# EAGLE schematic touch (EAGLE 7.3.0)
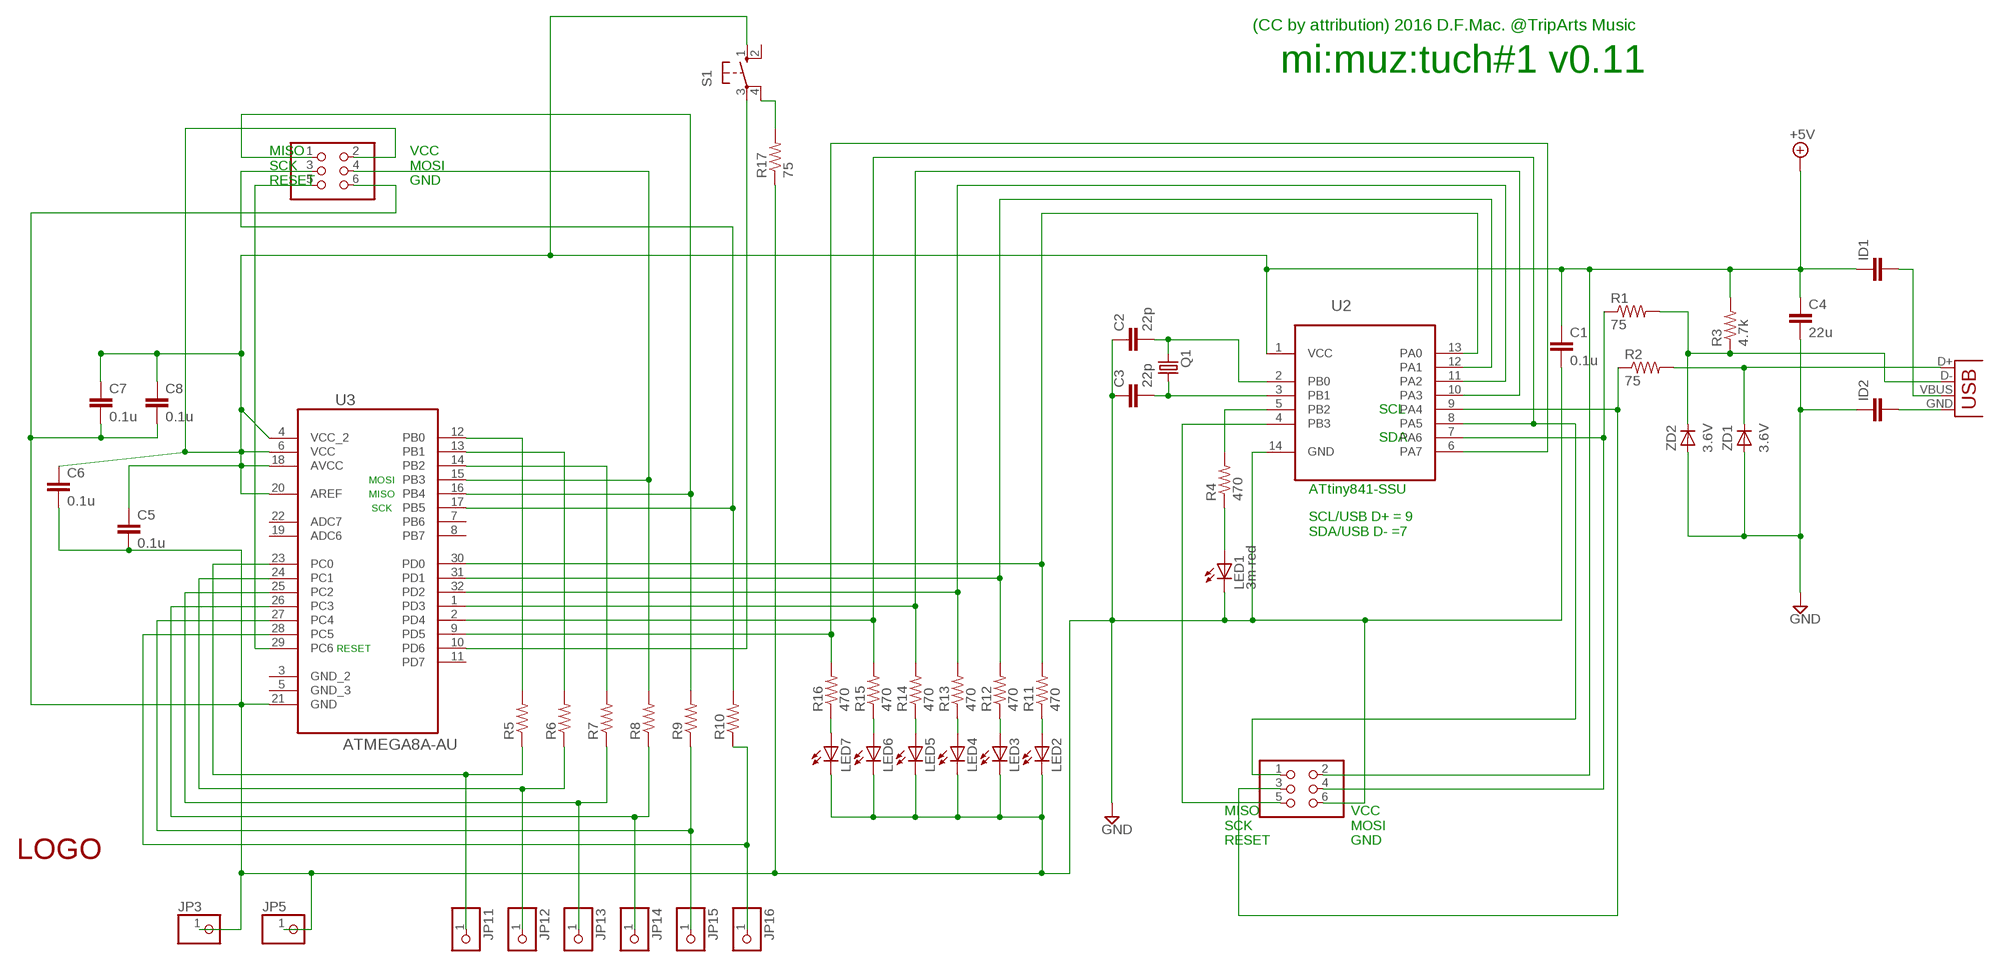
[diagram p0: schematic, sheet 1]

## Parts
C1  0.1u  C-EUC0603  [C0603]
C2  22p  C-EUC0603  [C0603]
C3  22p  C-EUC0603  [C0603]
C4  22u  C-EUC0805  [C0805]
C5  0.1u  C-EUC0603  [C0603]
C6  0.1u  C-EUC0603  [C0603]
C7  0.1u  C-EUC0603  [C0603]
C8  0.1u  C-EUC0603  [C0603]
ID1  C-EUC0805  [C0805]
ID2  C-EUC0805  [C0805]
JP1  PINHD-2X3  [2X03]
JP2  PINHD-2X3  [2X03]
JP3  PINHD-1X13MM  [1X01]
JP4  USB-MICROB  [USB-MICROB]
JP5  PINHD-1X13MM  [1X01]
JP11  PINHD-1X15MM  [1X01-LARGE]
JP12  PINHD-1X15MM  [1X01-LARGE]
JP13  PINHD-1X15MM  [1X01-LARGE]
JP14  PINHD-1X15MM  [1X01-LARGE]
JP15  PINHD-1X15MM  [1X01-LARGE]
JP16  PINHD-1X15MM  [1X01-LARGE]
LED1  3m-red  LED3MM  [LED3MM]
LED2  LED3MM  [LED3MM]
LED3  LED3MM  [LED3MM]
LED4  LED3MM  [LED3MM]
LED5  LED3MM  [LED3MM]
LED6  LED3MM  [LED3MM]
LED7  LED3MM  [LED3MM]
Q1  MC-405  [MC-405]
R1  75  R-US_R0603  [R0603]
R2  75  R-US_R0603  [R0603]
R3  4.7k  R-US_R0603  [R0603]
R4  470  R-US_R0603  [R0603]
R5  R-US_R0805  [R0805]
R6  R-US_R0805  [R0805]
R7  R-US_R0805  [R0805]
R8  R-US_R0805  [R0805]
R9  R-US_R0805  [R0805]
R10  R-US_R0805  [R0805]
R11  470  R-US_R0603  [R0603]
R12  470  R-US_R0603  [R0603]
R13  470  R-US_R0603  [R0603]
R14  470  R-US_R0603  [R0603]
R15  470  R-US_R0603  [R0603]
R16  470  R-US_R0603  [R0603]
R17  75  R-US_R0603  [R0603]
S1  10-XX  [B3F-10XX]
U2  ATTINY44-20SSU  [SOIC127P600X175-14N]
U3  ATMEGA8A-AU  [QFP80P900X900X120-32N]
U$1  LOGOSMALL  [LOGO-SMALL]
ZD1  3.6V  DIODE-SOD323-W  [SOD323-W]
ZD2  3.6V  DIODE-SOD323-W  [SOD323-W]

## Nets
+5V: C1.1 C4.1 C5.1 C6.1 C7.1 C8.1 ID1.1 JP1.2 JP2.2 R3.2 S1.1(S) U2.1(VCC) U3.4(VCC_2) U3.6(VCC) U3.18(AVCC) U3.20(AREF)
D+: JP4.D+ R2.2 ZD1.C
D-: JP4.D- R1.2 R3.1 ZD2.C
GND [power]: C1.2 C2.1 C3.1 C4.2 C5.2 C6.2 C7.2 C8.2 ID2.1 JP1.6 JP2.6 JP3.1 JP5.1 LED1.K(C) LED2.K(C) LED3.K(C) LED4.K(C) LED5.K(C) LED6.K(C) LED7.K(C) R17.1 U2.14(GND) U3.21(GND) ZD1.A ZD2.A
GND1: ID2.2 JP4.GND
N$1: R5.2 U3.12(PB0)
N$3: R4.2 U2.5(PB2)
N$5: C2.2 Q1.2 U2.2(PB0)
N$6: C3.2 Q1.1 U2.3(PB1)
N$7: R11.2 U2.13(PA0) U3.30(PD0)
N$8: LED1.A R4.1
N$9: R12.2 U2.12(PA1) U3.31(PD1)
N$10: R14.2 U2.10(PA3) U3.1(PD3)
N$11: JP11.1 R5.1 U3.23(PC0)
N$12: JP2.5 U2.4(PB3)
N$13: R13.2 U2.11(PA2) U3.32(PD2)
N$14: JP2.4 R1.1 U2.7(PA6)
N$15: R6.2 U3.13(PB1)
N$17: R17.2 S1.4(P1)
N$19: R7.2 U3.14(PB2)
N$20: JP1.4 R8.2 U3.15(PB3)
N$21: JP1.5 U3.29(PC6)
N$22: JP1.1 R9.2 U3.16(PB4)
N$23: JP1.3 R10.2 U3.17(PB5)
N$24: LED7.A R16.1
N$25: LED6.A R15.1
N$26: LED5.A R14.1
N$27: LED4.A R13.1
N$28: LED3.A R12.1
N$29: LED2.A R11.1
N$30: R16.2 U2.6(PA7) U3.9(PD5)
N$31: JP12.1 R6.1 U3.24(PC1)
N$32: JP13.1 R7.1 U3.25(PC2)
N$33: JP14.1 R8.1 U3.26(PC3)
N$34: JP15.1 R9.1 U3.27(PC4)
N$35: JP16.1 R10.1 U3.28(PC5)
N$36: S1.3(P) U3.10(PD6)
N$37: JP2.3 R2.1 U2.9(PA4)
N$39: JP2.1 R15.2 U2.8(PA5) U3.2(PD4)
VBUS: ID1.2 JP4.VBUS
Unconnected: S1.2(S1) U3.3(GND_2) U3.5(GND_3) U3.7(PB6) U3.8(PB7) U3.11(PD7) U3.19(ADC6) U3.22(ADC7)

## Notes on the sheet
- (CC by attribution) 2016 D.F.Mac. @TripArts Music
- mi:muz:tuch#1 v0.11
- MISO
  SCK
  RESET
- VCC
  MOSI
  GND
- SCL
- SDA
- MOSI
- MISO | ATtiny841-SSU
- SCK
- SCL/USB D+ = 9
  SDA/USB D- =7
- RESET
- MISO
  SCK
  RESET
- VCC
  MOSI
  GND

## Library data of the parts
C1-C8 ID1 ID2 = 0my:C-EU: CAPACITOR, European symbol
JP1 JP2 = pinhead:PINHD-2X3: PIN HEADER
JP3 JP5 JP11-JP16 = 0my:PINHD-1X1: PIN HEADER
JP4 = 0my:USB: USB Connectors USB-B-PTH is fully proven SKU : PRT-00139/CONN-08278 USB-miniB is fully proven SKU : PRT-00587 USB-A-PCB is untested. USB-A-H is throughly reviewed, but untested. Spark Fun Electronics SKU : PRT-00437 USB-B-SMT is throughly reviewed, but untested. Needs silkscreen touching up. USB-A-S has not been used/tested USB-MB-H has not been used/tested USB-MICROB has been used. CONN-09505; PROD_ID: CONN-09505
LED1-LED7 = led:LED: LED OSRAM: - CHIPLED LG R971, LG N971, LY N971, LG Q971, LY Q971, LO R971, LY R971 LH N974, LH R974 LS Q976, LO Q976, LY Q976 LO Q996 - Hyper CHIPLED LW Q18S LB Q993, LB Q99A, LB R99A - SideLED LS A670, LO A670, LY A670, LG A670, LP A670 LB A673, LV A673, LT A673, LW A673 LH A674 LY A675 LS A676, LA A676, LO A676, LY A676, LW A676 LS A679, LY A679, LG A679 - Hyper Micro SIDELED® LS Y876, LA Y876, LO Y876, LY Y876 LT Y87S - SmartLED LW L88C, LW L88S LB L89C, LB L89S, LG L890 LS L89K, LO L89K, LY L89K LS L896, LA L896, LO L896, LY L896 - TOPLED LS T670, LO T670, LY T670, LG T670, LP T670 LSG T670, LSP T670, LSY T670, LOP T670, LYG T670 LG T671, LOG T671, LSG T671 LB T673, LV T673, LT T673, LW T673 LH T674 LS T676, LA T676, LO T676, LY T676, LB T676, LH T676, LSB T676, LW T676 LB T67C, LV T67C, LT T67C, LS T67K, LO T67K, LY T67K, LW E67C LS E67B, LA E67B, LO E67B, LY E67B, LB E67C, LV E67C, LT E67C LW T67C LS T679, LY T679, LG T679 LS T770, LO T770, LY T770, LG T770, LP T770 LB T773, LV T773, LT T773, LW T773 LH T774 LS E675, LA E675, LY E675, LS T675 LS T776, LA T776, LO T776, LY T776, LB T776 LHGB T686 LT T68C, LB T68C - Hyper Mini TOPLED® LB M676 - Mini TOPLED Santana® LG M470 LS M47K, LO M47K, LY M47K Source: http://www.osram.convergy.de LUXEON: - LUMILED® LXK2-PW12-R00, LXK2-PW12-S00, LXK2-PW14-U00, LXK2-PW14-V00 LXK2-PM12-R00, LXK2-PM12-S00, LXK2-PM14-U00 LXK2-PE12-Q00, LXK2-PE12-R00, LXK2-PE12-S00, LXK2-PE14-T00, LXK2-PE14-U00 LXK2-PB12-K00, LXK2-PB12-L00, LXK2-PB12-M00, LXK2-PB14-N00, LXK2-PB14-P00, LXK2-PB14-Q00 LXK2-PR12-L00, LXK2-PR12-M00, LXK2-PR14-Q00, LXK2-PR14-R00 LXK2-PD12-Q00, LXK2-PD12-R00, LXK2-PD12-S00 LXK2-PH12-R00, LXK2-PH12-S00 LXK2-PL12-P00, LXK2-PL12-Q00, LXK2-PL12-R00 Source: www.luxeon.com KINGBRIGHT: KA-3528ASYC Source: www.kingbright.com
Q1 = 0my:MC-405: Cristal (SMD) 5032 SMD; OC_FARNELL: unknown; OC_NEWARK: unknown
R1-R17 = 0my:R-US_: RESISTOR, American symbol
S1 = 0my:10-XX: OMRON SWITCH; MPN: B3F-1000; OC_FARNELL: 176432; OC_NEWARK: 36M3542
U2 = Atmel_By_element14_Batch_1-00:ATTINY44-20SSU: 8-bit Microcontroller with Bytes In-System Programmable Flash; MPN: ATTINY44-20SSU; OC_FARNELL: 1455152; OC_NEWARK: 58M3787; PACKAGE: SOIC-14; SUPPLIER: Atmel
U3 = 0my:ATMEGA8A-AU: Programmable Flash; MPN: ATMEGA8A-AU; OC_FARNELL: 1748532; OC_NEWARK: 26R5638; PACKAGE: TQFP-32; SUPPLIER: Atmel
U$1 = 0my:LOGO
ZD1 ZD2 = 0my:DIODE-: DIODE

## Net classes
0 default: width 0.432 mm, clearance 0.305 mm
1 power: width 0.533 mm, clearance 0.305 mm
2 D+: width 0.381 mm, clearance 0.203 mm
3 D-: width 0.381 mm, clearance 0.203 mm
4 GND1: width 0.381 mm, clearance 0.203 mm
5 VBUS: width 0.381 mm, clearance 0.203 mm